# Altium project Digital_Azan_Clock.PrjPcb (part 2 of 2)

## Sheet Sensor_Sheet.SchDoc
size A; SheetNumber: 5; SheetTotal: 6
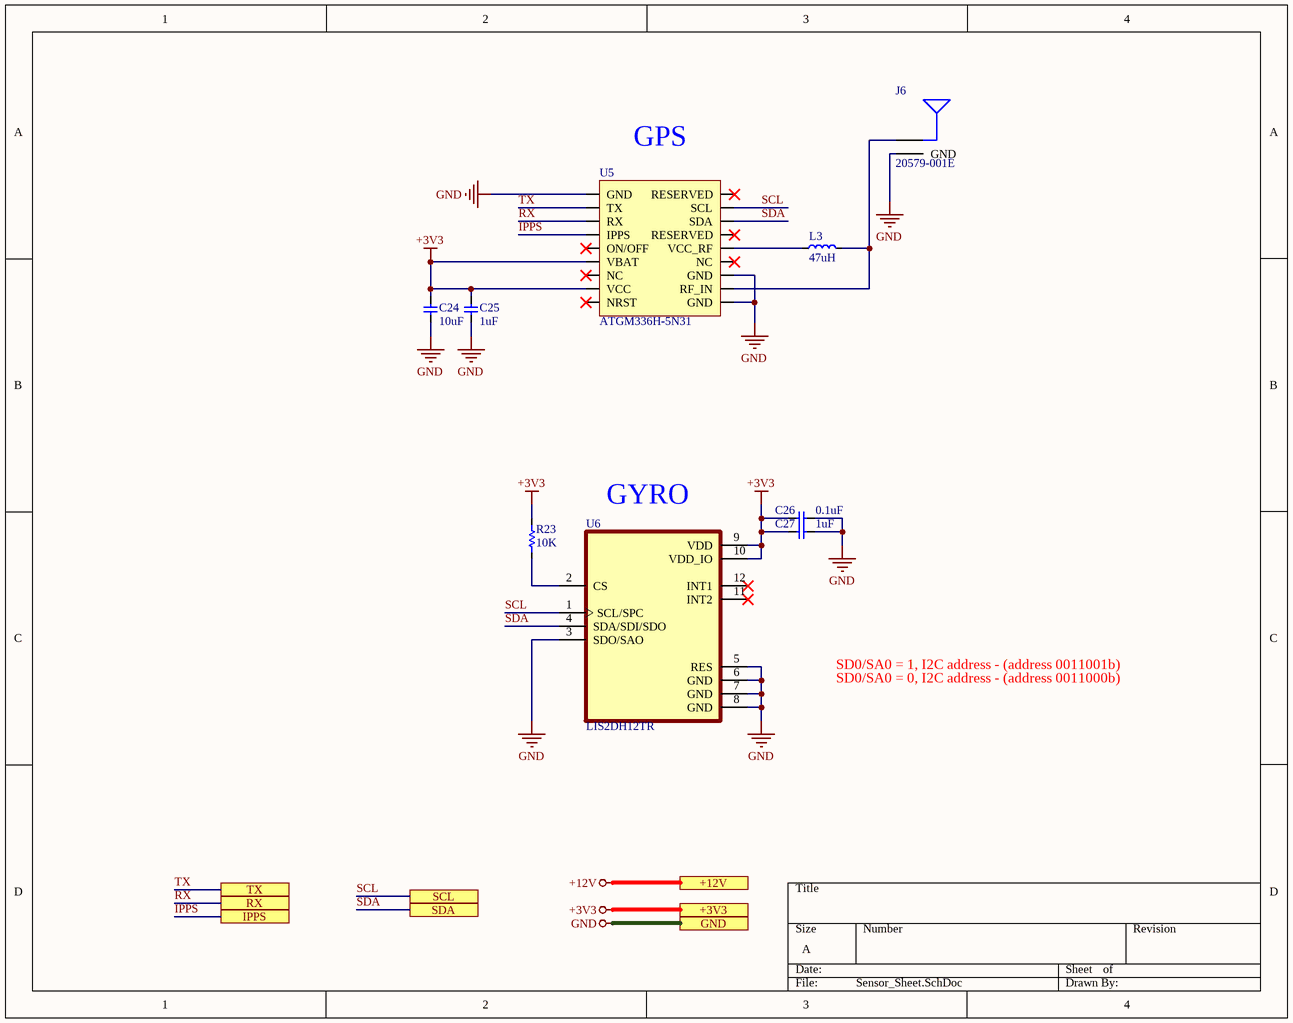
[diagram p2: Sensor_Sheet.SchDoc]

### Parts
C24  10uF  [Cap-0603]
C25  1uF  [Cap-0603]
C26  0.1uF  [Cap-0603]
C27  1uF  [Cap-0603]
J6  20579-001E  [IPEX-1]
L3  47uH  [CYA0650-47UH]
R23  10K  [Res-0603]
U5  ATGM336H-5N31  [ATGM336H]
U6  LIS2DH12TR  [PQFN50P200X200100-12N]

### Ports
+3V3 (see Top_Sheet[3B], Amplifier_Sheet[3D], Controller_Sheet[3D], LCD_Sheet[3D], Power_Sheet[3D]), +12V (see Top_Sheet[3B], Amplifier_Sheet[3D], Power_Sheet[3D]), GND (see Top_Sheet[3B], Amplifier_Sheet[3D], Controller_Sheet[3D], LCD_Sheet[3D], Power_Sheet[3D]), IPPS (see Top_Sheet[3B], Controller_Sheet[1D]), RX (see Top_Sheet[3B], Controller_Sheet[1D]), SCL (see Top_Sheet[3B], Amplifier_Sheet[2D], Controller_Sheet[1D], LCD_Sheet[1D]), SDA (see Top_Sheet[3B], Amplifier_Sheet[2D], Controller_Sheet[1D], LCD_Sheet[1D]), TX (see Top_Sheet[3B], Controller_Sheet[1D])

### Nets
+3V3: C24.2 C25.2 C26.1 C27.1 R23.2 U5.6(VBAT) U5.8(VCC) U6.9(VDD) U6.10(VDD_IO) ; port +3V3
GND: C24.1 C25.1 C26.2 C27.2 J6.2(GND) U5.1(GND) U5.10(GND) U5.12(GND) U6.3(SDO/SAO) U6.5(RES) U6.6(GND) U6.7(GND) U6.8(GND) ; port GND
IPPS: U5.4(IPPS) ; port IPPS
RX: U5.3(RX) ; port RX
SCL: U5.17(SCL) U6.1(SCL/SPC) ; port SCL
SDA: U5.16(SDA) U6.4(SDA/SDI/SDO) ; port SDA
TX: U5.2(TX) ; port TX
NetJ6_1: J6.1(SIGNAL) L3.2 U5.11(RF_IN)
NetL3_1: L3.1 U5.14(VCC_RF)
NetR23_1: R23.1 U6.2(CS)

Not connected (* = marked no-connect by the designer): U5 5(ON/OFF)* 7(NC)* 9(NRST)* 13(NC)* 15(RESERVED)* 18(RESERVED)*; U6 11(INT2)* 12(INT1)*

### Notes on the sheet
- (near U5) GPS
- (near U6) GYRO
- SD0/SA0 = 1, I2C address - (address 0011001b)
- SD0/SA0 = 0, I2C address - (address 0011000b)

### Library data of the parts
C24 = GRM188R6YA106MA73D: 10uF 35V X5R 20% Pad SMD 0603; Manufacturer: Murata; Supplier 1: Arrow Electronics; Manufacturer Part Number: GRM188R6YA106MA73D; RoHS: Yes; Category: Ceramic Capacitors; Stock 1: 37601; Pricing 1: 1=0.36650, 10=0.23380, 25=0.23160, 100=0.15050, 250=0.14890, 500=0.10700, 1000=0.09270, 3000=0.08640, 6000=0.07720, 15000=0.07140, 30000=0.05840 (USD); Mount: Surface Mount; Case/Package: 0603; Case Code (Metric): 1608; Case Code (Imperial): 0603; Min Operating Temperature: -55°C; Max Operating Temperature: 85°C; Packaging: Tape and Reel; Capacitance: 10uF; Voltage Rating: 35V; Tolerance: 20%; Voltage Rating (DC): 35V; Dielectric: X5R; Length: 0.063inch; Width: 0.031inch; Thickness: 0.039inch; RoHS Compliant: Yes; ComponentLink1URL: http://search.murata.co.jp/Ceramy/image/img/A01X/G101/ENG/GRM188R6YA106MA73-01.pdf?src-supplier=Future+Electronics; ComponentLink1Description: http://search.murata.co.jp/Ceramy/image/img/A01X/G101/ENG/GRM188R6YA106MA73-01.pdf?src-supplier=Future+Electronics; ComponentLink2URL: http://search.murata.co.jp/Ceramy/image/img/A01X/G101/ENG/GRM188R6YA106MA73-01.pdf?src-supplier=Digi-Key; ComponentLink2Description: http://search.murata.co.jp/Ceramy/image/img/A01X/G101/ENG/GRM188R6YA106MA73-01.pdf?src-supplier=Digi-Key; ComponentLink3URL: https://www.murata.com/~/media/webrenewal/support/library/catalog/products/capacitor/mlcc/c02e.ashx?la=en-us&src-supplier=Digi-Key; ComponentLink3Description: https://www.murata.com/~/media/webrenewal/support/library/catalog/products/capacitor/mlcc/c02e.ashx?la=en-us&src-supplier=Digi-Key; ComponentLink4URL: http://search.murata.co.jp/Ceramy/image/img/A01X/G101/ENG/GRM188R6YA106MA73-01.pdf?src-supplier=Mouser; ComponentLink4Description: http://search.murata.co.jp/Ceramy/image/img/A01X/G101/ENG/GRM188R6YA106MA73-01.pdf?src-supplier=Mouser; ComponentLink5URL: http://search.murata.co.jp/Ceramy/image/img/A01X/G101/ENG/GRM188R6YA106MA73-01.pdf?src-supplier=TTI; ComponentLink5Description: http://search.murata.co.jp/Ceramy/image/img/A01X/G101/ENG/GRM188R6YA106MA73-01.pdf?src-supplier=TTI; Supplier Part Number 1: GRM188R6YA106MA73D; LCSC Part Number: C194427
C25 C27 = CC0603KRX5R8BB105: CAP CER 1UF 25V X5R 0603; Manufacturer: Yageo; Tolerance: 10%; Item Type: Capacitor; Supplier 1: Digi-Key; Manufacturer Part Number: CC0603KRX5R8BB105; RoHS: Yes; Category: Ceramic Capacitors; Stock 1: 919939; Pricing 1: 1=0.12000, 10=0.08400, 50=0.04760, 100=0.03940, 500=0.02764, 1000=0.02288 (USD); Mount: Surface Mount; Case/Package: 0603; Number of Pins: 2; Case Code (Metric): 1608; Case Code (Imperial): 0603; Min Operating Temperature: -55°C; Max Operating Temperature: 85°C; Capacitance: 1uF; Dielectric: X5R; Package Quantity: 1; Voltage Rating: 25V; Packaging: Tape and Reel; Termination: SMD/SMT; Voltage Rating (DC): 25V; Series: CC; Construction: Flat; Length: 1.6mm; Width: 0.031inch; Height: 0.8mm; Thickness: 0.035inch; Depth: 0.8mm; Radiation Hardening: No; REACH SVHC: No SVHC; Lead Free: Lead Free; Halogen Free: Halogen Free; RoHS Compliant: Yes; ComponentLink1URL: https://datasheet.ciiva.com/176/mlccorderingcode-176785.pdf?src-supplier=Digi-Key; ComponentLink1Description: https://datasheet.ciiva.com/176/mlccorderingcode-176785.pdf?src-supplier=Digi-Key; ComponentLink2URL: https://datasheet.ciiva.com/176/mlccorderingcode-176786.pdf?src-supplier=Digi-Key; ComponentLink2Description: https://datasheet.ciiva.com/176/mlccorderingcode-176786.pdf?src-supplier=Digi-Key; ComponentLink3URL: https://datasheet.ciiva.com/176/mlccorderingcode-176787.pdf?src-supplier=Digi-Key; ComponentLink3Description: https://datasheet.ciiva.com/176/mlccorderingcode-176787.pdf?src-supplier=Digi-Key; ComponentLink4URL: https://datasheet.ciiva.com/17436/upy-gphc-x5r-4v-to-50v-12-17436952.pdf?src-supplier=Avnet+Europe; ComponentLink4Description: https://datasheet.ciiva.com/17436/upy-gphc-x5r-4v-to-50v-12-17436952.pdf?src-supplier=Avnet+Europe; ComponentLink5URL: https://datasheet.ciiva.com/7978/1525783-7978171.pdf?src-supplier=Element14; ComponentLink5Description: https://datasheet.ciiva.com/7978/1525783-7978171.pdf?src-supplier=Element14; ComponentLink6URL: https://datasheet.ciiva.com/11586/upy-gphc-x5r-4v-to-50v-12-11586318.pdf?src-supplier=Avnet; ComponentLink6Description: https://datasheet.ciiva.com/11586/upy-gphc-x5r-4v-to-50v-12-11586318.pdf?src-supplier=Avnet; Supplier Part Number 1: 311-1445-1-ND; LCSC Part Number: C14664
C26 = CC0603KRX7R0BB104: CAP CER 0.1UF 100V X7R 0603; Manufacturer: Yageo; Capacitance: 100nF; Tolerance: 10%; Item Type: Capacitor; Supplier 1: Digi-Key; Manufacturer Part Number: CC0603KRX7R0BB104; RoHS: Yes; Category: Ceramic Capacitors; Stock 1: 60476; Pricing 1: 1=0.19000, 10=0.13500, 50=0.07680, 100=0.06370, 500=0.04466, 1000=0.03696 (USD); Mount: Surface Mount; Case/Package: 0603; Case Code (Metric): 1608; Case Code (Imperial): 0603; Weight: 7.1E-05oz; Min Operating Temperature: -55°C; Max Operating Temperature: 125°C; Package Quantity: 4000; Voltage Rating: 100V; Packaging: Tape and Reel; Dielectric: X7R; Termination: SMD/SMT; Resistor Type: Ceramic; Voltage Rating (DC): 100V; Series: CC; Length: 0.063inch; Width: 0.031inch; Thickness: 0.035inch; Depth: 0.8mm; Lead Free: Lead Free; RoHS Compliant: Yes; ComponentLink1URL: https://datasheet.ciiva.com/6277/mlccorderingcode-6277030.pdf?src-supplier=Digi-Key; ComponentLink1Description: https://datasheet.ciiva.com/6277/mlccorderingcode-6277030.pdf?src-supplier=Digi-Key; ComponentLink2URL: https://datasheet.ciiva.com/6277/mlccorderingcode-6277081.pdf?src-supplier=Digi-Key; ComponentLink2Description: https://datasheet.ciiva.com/6277/mlccorderingcode-6277081.pdf?src-supplier=Digi-Key; ComponentLink3URL: https://datasheet.ciiva.com/6277/mlccorderingcode-6277082.pdf?src-supplier=Digi-Key; ComponentLink3Description: https://datasheet.ciiva.com/6277/mlccorderingcode-6277082.pdf?src-supplier=Digi-Key; Supplier Part Number 1: 311-1523-1-ND; LCSC Part Number: C113803
J6 = IPEX-0001: The M.2 industry standard,support up to 12 GHz; Manufacturer: I-PEX; Item Type: Antenna; Value: *; Package: None; Price: None; Manufacturer Part Number: 20579-001E; Availability: Unavailable; SnapEDA_Link: https://www.snapeda.com/parts/20579-001E/I-PEX/view-part/4300957/?ref=snap; LCSC Part Number: C2987682; ComponentLink1Description: LCSC Link; ComponentLink1URL: https://www.lcsc.com/product-detail/RF-Connectors-Coaxial-Connectors_ZIISOR-IPEX-1_C2987682.html
L3 = CYA0650-47UH: 2A 47uH ±20% 250mΩ SMD,6.6x7.2mm Inductors (SMD) ROHS; Manufacturer: SHOU HAN; Manufacturer Part Number: CYA0650-47UH; Package: SMD,6.6x7.2mm; LCSC Part Number: C5189938; Item Type: Inductor; ComponentLink1Description: LCSC; ComponentLink1URL: https://www.lcsc.com/product-detail/Inductors-SMD_SHOU-HAN-CYA0650-47UH_C5189938.html
R23 = RT0603BRD0710KL: RES SMD 10K OHM 0.1% 1/10W 0603; Manufacturer: Yageo; Power: 100mW; Rated Temperature: 70°C; Value: 10kR; Temperature Coefficient: 25ppm/°C; Working Voltage: 75V; Package Height: 0.45mm; Package Length: 1.6mm; Package Width: 0.8mm; Item Type: Resistor; Supplier 1: Rs; Manufacturer Part Number: RT0603BRD0710KL; RoHS: Yes; Category: Chip SMD Resistors; Stock 1: 20510; Pricing 1: 100=0.29800, 250=0.27800, 500=0.25900, 1000=0.23700 (GBP); Mounting Technology: Surface Mount; Pins: 2; Case/Package: 0603; Min Operating Temperature: -55°C; Max Operating Temperature: 155°C; Tolerance: 0.1%; Resistor Type: FIXED RESISTOR; Construction: Chip; Package Style: SMTMeter; Packaging: Tape and Reel; Technology: THIN FILM; Termination: Wraparound; Reach SVHC Compliant: Yes; RoHS Compliant: Yes; ComponentLink1URL: https://datasheet.ciiva.com:443/pdfs/VipMasterIC/IC/YAGO/YAGO-S-A0008510989/YAGO-S-A0008510989-1.pdf?src-supplier=IHS+Markit; ComponentLink1Description: https://datasheet.ciiva.com:443/pdfs/VipMasterIC/IC/YAGO/YAGO-S-A0008510989/YAGO-S-A0008510989-1.pdf?src-supplier=IHS+Markit; ComponentLink2URL: https://datasheet.ciiva.com/5624/pyu-rt-1-to-0-05-rohs-l-4-5624351.pdf?src-supplier=Mouser; ComponentLink2Description: https://datasheet.ciiva.com/5624/pyu-rt-1-to-0-05-rohs-l-4-5624351.pdf?src-supplier=Mouser; ComponentLink3URL: https://datasheet.ciiva.com/29721/pyu-rt-1-to-0-05-rohs-l-4-29721177.pdf?src-supplier=Digi-Key; ComponentLink3Description: https://datasheet.ciiva.com/29721/pyu-rt-1-to-0-05-rohs-l-4-29721177.pdf?src-supplier=Digi-Key; Supplier Part Number 1: 1991391P; LCSC Part Number: C95204
U5 = ATGM336H-5N31: SMD,9.7x10.1mm Satellite Positioning Modules ROHS; Manufacturer: ZHONGKEWEI; Item Type: GPS; Manufacturer Part Number: ATGM336H-5N31; LCSC Part Number: C90770; Package: SMD,9.7x10.1mm; ComponentLink1Description: LCSC Link; ComponentLink1URL: https://www.lcsc.com/product-detail/Satellite-Positioning-Modules_ZHONGKEWEI-ATGM336H-5N31_C90770.html
U6 = LIS2DH12TR: Accelerometer X, Y, Z Axis Â±2g, 4g, 8g, 16g 0.5Hz ~ 672Hz 12-LGA (2x2); Manufacturer: STMicroelectronics; Item Type: Gyro; Package: LGA-12 STMicroelectronics; Availability: In Stock; Value: *; Manufacturer Part Number: LIS2DH12TR; Check_prices: https://www.snapeda.com/parts/LIS2DH12TR/STMicroelectronics/view-part/?ref=eda; Purchase-URL: https://pricing.snapeda.com/search/part/LIS2DH12TR/?ref=eda; Price: None; SnapEDA_Link: https://www.snapeda.com/parts/LIS2DH12TR/STMicroelectronics/view-part/?ref=snap; LCSC Part Number: C110926; ComponentLink1Description: LCSC Link; ComponentLink1URL: https://www.lcsc.com/product-detail/Attitude-Sensor-Gyroscope_STMicroelectronics-LIS2DH12TR_C110926.html

## Nets that join several sheets
+3V3: Power_Sheet (C10.1 D3.2 D4.1 R27.2), Amplifier_Sheet (6 pins), Sensor_Sheet (9 pins)
+12V: Power_Sheet (6 pins), Amplifier_Sheet (9 pins)
GND: Power_Sheet (27 pins), Amplifier_Sheet (15 pins), Sensor_Sheet (13 pins)
SCL: Amplifier_Sheet (R21.2 U4.8), Sensor_Sheet (U5.17 U6.1)
SDA: Amplifier_Sheet (R22.2 U4.9), Sensor_Sheet (U5.16 U6.4)